# EAGLE design rev3 (EAGLE 7.2.0)
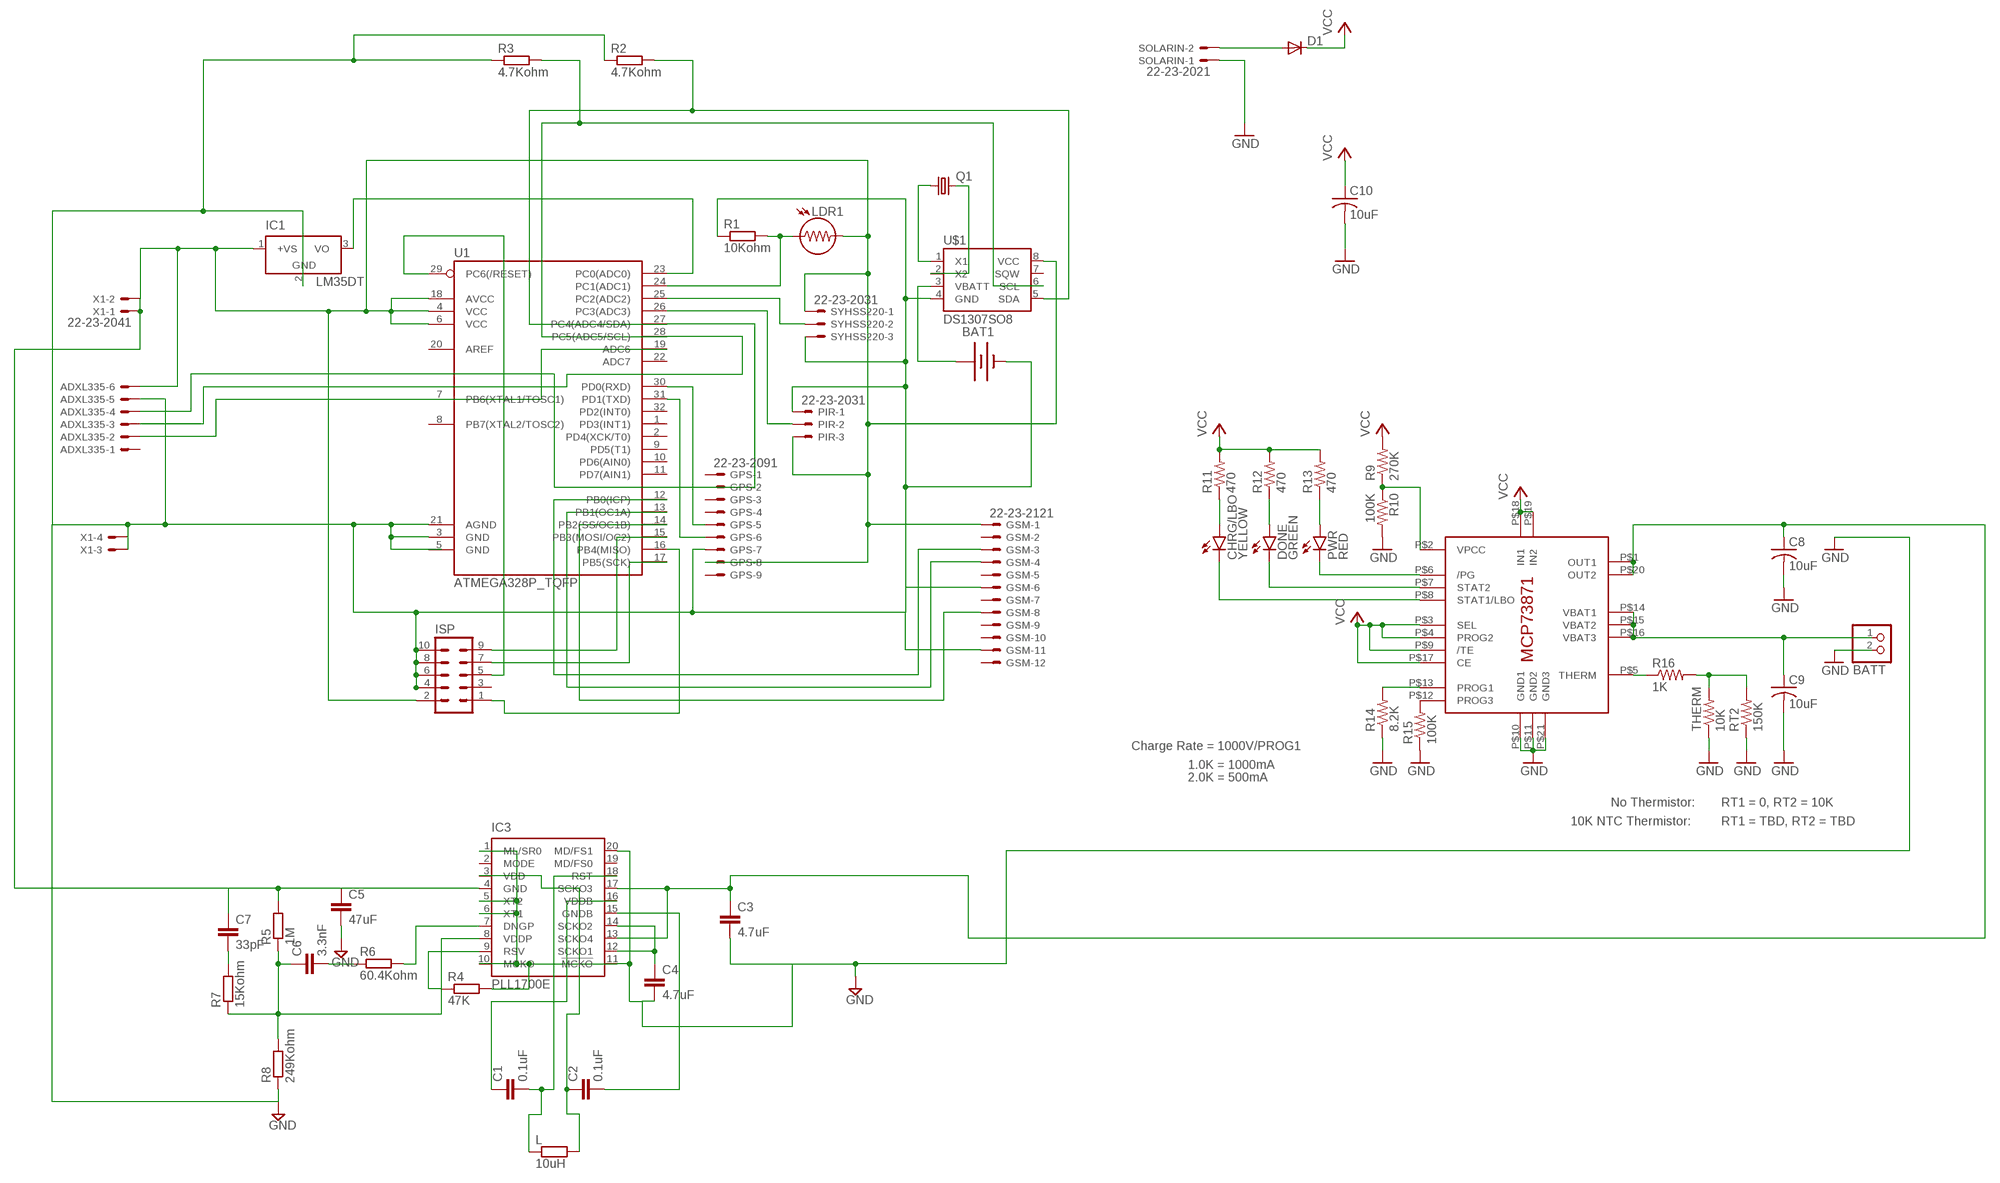
[diagram p0: schematic, sheet 1]

## Parts
ADXL335  22-23-2061  [22-23-2061]
BAT1  BATTERY20PTH  [BATTCOM_20MM_PTH]
BATT  JST_2PIN-SMT-RA  [JST-PH-2-SMT-RA]
C1  0.1uF  0.1UF-16V(+-10%)(0402)  [0402-CAP]
C2  0.1uF  0.1UF-16V(+-10%)(0402)  [0402-CAP]
C3  4.7uF  4.7UF-6.3V-10%(0603)0603  [0603-CAP]
C4  4.7uF  4.7UF-6.3V-10%(0603)0603  [0603-CAP]
C5  47uF  CAP0603-CAP  [0603-CAP]
C6  3.3nF  3.3NF-100V-10%(0603)  [0603-CAP]
C7  33pF  33PF-50V-5%-(0603)  [0603-CAP]
C8  10uF  C-USC0805K  [C0805K]
C9  10uF  C-USC0805K  [C0805K]
C10  10uF  C-USC0805K  [C0805K]
CHRG/LBO  YELLOW  LED-YELLOWLARGE  [LED-1206]
D1  DIODEPTH  [DIODE-1N4001]
DONE  GREEN  LED-GREENLARGE  [LED-1206]
GPS  22-23-2091  [22-23-2091]
GSM  22-23-2121  [22-23-2121]
IC1  LM35DT  [TO220V]
IC2  MCP73871  [QFN20_4MM]
IC3  PLL1700E  [SSOP20]
ISP  ML10  [ML10]
L  10uH  6MM-EU4  [R0207/4]
LDR1  LDR5MM  [LDR338-54C]
PIR  22-23-2031  [22-23-2031]
PWR  RED  LED-RED1206  [LED-1206]
Q1  CRYSTALTC26H  [TC26H]
R1  10Kohm  R-EU_M1206  [M1206]
R2  4.7Kohm  R-EU_M1206  [M1206]
R3  4.7Kohm  R-EU_M1206  [M1206]
R4  47K  R-EU_M3216  [M3216]
R5  1M  R-EU_M3216  [M3216]
R6  60.4Kohm  R-EU_M3216  [M3216]
R7  15Kohm  R-EU_M1206  [M1206]
R8  249Kohm  R-EU_M1206  [M1206]
R9  270K  R-US_R0805  [R0805]
R10  100K  R-US_R0805  [R0805]
R11  470  470OHM1/10W1%(0603)  [0603-RES]
R12  470  470OHM1/10W1%(0603)  [0603-RES]
R13  470  470OHM1/10W1%(0603)  [0603-RES]
R14  8.2K  8.2KOHM-1/10W-5%(0603)  [0603-RES]
R15  100K  R-US_R0805  [R0805]
R16  1K  R-US_M0805  [M0805]
RT2  150K  R-US_M0805  [M0805]
SOLARIN  22-23-2021  [22-23-2021]
SYHSS220  22-23-2031  [22-23-2031]
THERM  10K  R-US_FLIPFLOP  [0805-THM]
U1  ATMEGA328P_TQFP  [TQFP32-08]
U$1  DS1307SO8  [SO08]
X1  22-23-2041  [22-23-2041]

## Nets
BATT: BATT.1 C9.1 IC2.P$14(VBAT1) IC2.P$15(VBAT2) IC2.P$16(VBAT3)
GND: ADXL335.5 BAT1.2(-) BATT.2 C3.2 C4.2 C5.2 C8.2 C9.2 C10.2 GPS.7 GSM.6 GSM.11 IC1.2(GND) IC2.P$10(GND1) IC2.P$11(GND2) IC2.P$21(GND3) IC3.1(ML/SR0) IC3.5(XT2) IC3.6(XT1) IC3.10(MCKO) IC3.11(!MCKO) IC3.20(MD/FS1) ISP.4 ISP.6 ISP.8 ISP.10 PIR.1 R1.1 R2.1 R3.1 R4.2 R8.1 R10.2 R14.1 R15.1 RT2.1 SOLARIN.1 SYHSS220.3 THERM.1 U1.3(GND) U1.21(AGND) U$1.4(GND) X1.3 X1.4
N$3: GPS.5 U1.30(PD0(RXD))
N$4: IC1.3(VO) U1.23(PC0(ADC0))
N$5: LDR1.1 R1.2 U1.24(PC1(ADC1))
N$6: GPS.6 U1.31(PD1(TXD))
N$7: SYHSS220.2 U1.25(PC2(ADC2))
N$8: PIR.2 U1.26(PC3(ADC3))
N$9: ADXL335.2 U1.19(ADC6)
N$10: ADXL335.3 R3.2 U1.28(PC5(ADC5/SCL)) U$1.6(SCL)
N$11: GSM.3 U1.12(PB0(ICP))
N$12: Q1.1 U$1.1(X1)
N$13: Q1.2 U$1.2(X2)
N$14: GSM.4 U1.13(PB1(OC1A))
N$15: BAT1.1(+) U$1.3(VBATT)
N$16: GSM.8 U1.14(PB2(SS/OC1B))
N$17: IC2.P$2(VPCC) R9.1 R10.1
N$18: IC2.P$6(/PG) PWR.C
N$20: ISP.1 U1.16(PB4(MISO))
N$21: ISP.5 U1.29(PC6(/RESET))
N$22: ISP.7 U1.17(PB5(SCK))
N$23: ISP.9 U1.15(PB3(MOSI/OC2))
N$27: DONE.C IC2.P$7(STAT2)
N$28: CHRG/LBO.C IC2.P$8(STAT1/LBO)
N$29: C1.1 IC3.16(VDDB)
N$30: CHRG/LBO.A R11.1
N$31: DONE.A R12.1
N$32: C2.2 IC3.15(GNDB)
N$33: PWR.A R13.1
N$34: IC2.P$12(PROG3) R15.2
N$35: C1.2 IC3.18(RST) L.1
N$36: C2.1 IC3.3(VDD) L.2
N$37: ADXL335.6 C5.1 C7.1 GPS.8 GSM.1 IC1.1(+VS) IC3.4(GND) ISP.2 LDR1.2 PIR.3 R5.2 SYHSS220.1 U1.4(VCC) U1.6(VCC) U1.18(AVCC) U$1.8(VCC) X1.1 X1.2
N$38: C6.1 IC3.8(VDDP) R5.1 R7.1 R8.2
N$40: C6.2 R6.1
N$41: IC3.7(DNGP) R6.2
N$42: ADXL335.4 R2.2 U1.27(PC4(ADC4/SDA)) U$1.5(SDA)
N$43: C7.2 R7.2
N$44: C4.1 IC3.12(SCKO1) IC3.14(SCKO2)
N$45: IC3.9(RSV) R4.1
N$46: IC2.P$13(PROG1) R14.2
N$47: IC2.P$5(THERM) R16.1
N$48: R16.2 RT2.2 THERM.2
N$49: D1.A SOLARIN.2
OUT: C3.1 C8.1 IC2.P$1(OUT1) IC2.P$20(OUT2) IC3.13(SCKO4) IC3.17(SCKO3)
VCC: C10.1 D1.C IC2.P$3(SEL) IC2.P$4(PROG2) IC2.P$9(/TE) IC2.P$17(CE) IC2.P$18(IN1) IC2.P$19(IN2) R9.2 R11.2 R12.2 R13.2
Unconnected: ADXL335.1 GPS.1 GPS.2 GPS.3 GPS.4 GPS.9 GSM.2 GSM.5 GSM.7 GSM.9 GSM.10 GSM.12 IC3.2(MODE) IC3.19(MD/FS0) ISP.3 U1.1(PD3(INT1)) U1.2(PD4(XCK/T0)) U1.5(GND) U1.7(PB6(XTAL1/TOSC1)) U1.8(PB7(XTAL2/TOSC2)) U1.9(PD5(T1)) U1.10(PD6(AIN0)) U1.11(PD7(AIN1)) U1.20(AREF) U1.22(ADC7) U1.32(PD2(INT0)) U$1.7(SQW)

## Notes on the sheet
- Charge Rate = 1000V/PROG1
- 1.0K = 1000mA
- 2.0K = 500mA
- No Thermistor: | RT1 = 0, RT2 = 10K
- 10K NTC Thermistor: | RT1 = TBD, RT2 = TBD

## Library data of the parts
ADXL335 = con-molex:22-23-2061: .100" (2.54mm) Center Header - 6 Pin; MF: MOLEX; MPN: 22-23-2061; OC_FARNELL: 1462922; OC_NEWARK: 27C1933
BAT1 = SparkFun:BATTERY: Battery Holders Various common sizes : AA, AAA, 20mm coin cell and 12mm coin cell.
BATT = adafruit:JST_2PIN: JST 2-Pin Connectors of various flavors SMT-RA (S2B-PH-SM4) 4UConnector #17311 SMT (B2B-PH-SM4) THM-RA (S2B-PH) THM (B2B-PH)
C1 C2 = SparkFun-Capacitors:0.1UF-16V(+-10%)(0402); PROD_ID: CAP-12416
C3 C4 = SparkFun-Capacitors:4.7UF-6.3V-10%(0603): CAP-08280; PROD_ID: CAP-08280
C5 = SparkFun:CAP: Capacitor Standard 0603 ceramic capacitor, and 0.1" leaded capacitor.
C6 = SparkFun-Capacitors:3.3NF-100V-10%(0603): CAP-09633; PROD_ID: CAP-09633
C7 = SparkFun-Capacitors:33PF-50V-5%-(0603): CAP-10142; PROD_ID: CAP-10142
C8-C10 = adafruit:C-US: CAPACITOR, American symbol
CHRG/LBO = SparkFun-LED:LED-YELLOW: Yellow SMD LEDs LilyPad 1206- DIO-09909 0603- DIO-09003; PROD_ID: DIO-00820
D1 = SparkFun:DIODE: Diode These are standard reverse protection diodes and small signal diodes. SMA package can handle up to about 1A. SOD-323 can handle about 200mA. What the SOD-323 package when ordering, there are some mfgs out there that are 5-pin packages.
DONE = SparkFun-LED:LED-GREEN: Various green LEDs Green LEDs used in SFE Production 0603- DIO-00821 LARGE- DIO-00862 LILYPAD- DIO-09910; PROD_ID: DIO-00862
GPS = con-molex:22-23-2091: .100" (2.54mm) Center Header - 9 Pin; MF: MOLEX; MPN: 22-23-2091; OC_FARNELL: 1756827; OC_NEWARK: 56H0450
GSM = con-molex:22-23-2121: .100" (2.54mm) Center Header - 12 Pin; MF: MOLEX; MPN: 22-23-2121; OC_FARNELL: 1462935; OC_NEWARK: 56H0456
IC1 = lm35:LM35: Single-Supply Centigrade Temperature Sensor Vout = (10mV/°C x Temp °C) +5mmmV Source: http://www.national.com/ds/LM/LM35.pdf
IC2 = adafruit:MCP73871
IC3 = texas:PLL1700*: MULTI-CLOCK GENERATOR GENERATED AUDIO SYSTEM CLOCK Phase Lock Loop (PLL).; MF: TEXAS INSTRUMENT CONNECTORS; MPN: PLL1700E; OC_FARNELL: unknown; OC_NEWARK: 36K3452
ISP = con-harting-ml:ML10: HARTING; OC_FARNELL: unknown; OC_NEWARK: unknown
L = gm-resistors:6MM-EU: 6mm Resistors (European schematic symbol) Leads spaced 1-6 holes apart for 0.1" perfboard. Suitable for 1/4 watt resistors.
LDR1 = gm-resistors:LDR
PIR SYHSS220 = con-molex:22-23-2031: .100" (2.54mm) Center Header - 3 Pin; MF: MOLEX; MPN: 22-23-2031; OC_FARNELL: 1462950; OC_NEWARK: 30C0862
PWR = SparkFun-LED:LED-RED: Assorted Red LEDs LilyPad 1206- DIO-09912 1206- DIO-00809 0603- DIO-00819; PROD_ID: DIO-00809
Q1 = crystal:CRYSTAL: CRYSTAL; OC_FARNELL: unknown; OC_NEWARK: unknown
R1-R8 = resistor:R-EU_: RESISTOR, European symbol
R9 R10 R15 R16 RT2 THERM = adafruit:R-US_: RESISTOR, American symbol
R11-R13 = SparkFun-Resistors:470OHM1/10W1%(0603): RES-07869; PROD_ID: RES-07869
R14 = SparkFun-Resistors:8.2KOHM-1/10W-5%(0603): RES-10646; PROD_ID: RES-10646
SOLARIN = con-molex:22-23-2021: .100" (2.54mm) Center Header - 2 Pin; MF: MOLEX; MPN: 22-23-2021; OC_FARNELL: 1462926; OC_NEWARK: 25C3832
U1 = SparkFun-DigitalIC:ATMEGA328P_TQFP; PROD_ID: IC-09069
U$1 = SparkFun:DS1307
X1 = con-molex:22-23-2041: .100" (2.54mm) Center Header - 4 Pin; MF: MOLEX; MPN: 22-23-2041; OC_FARNELL: 1462920; OC_NEWARK: 38C0355

## Board
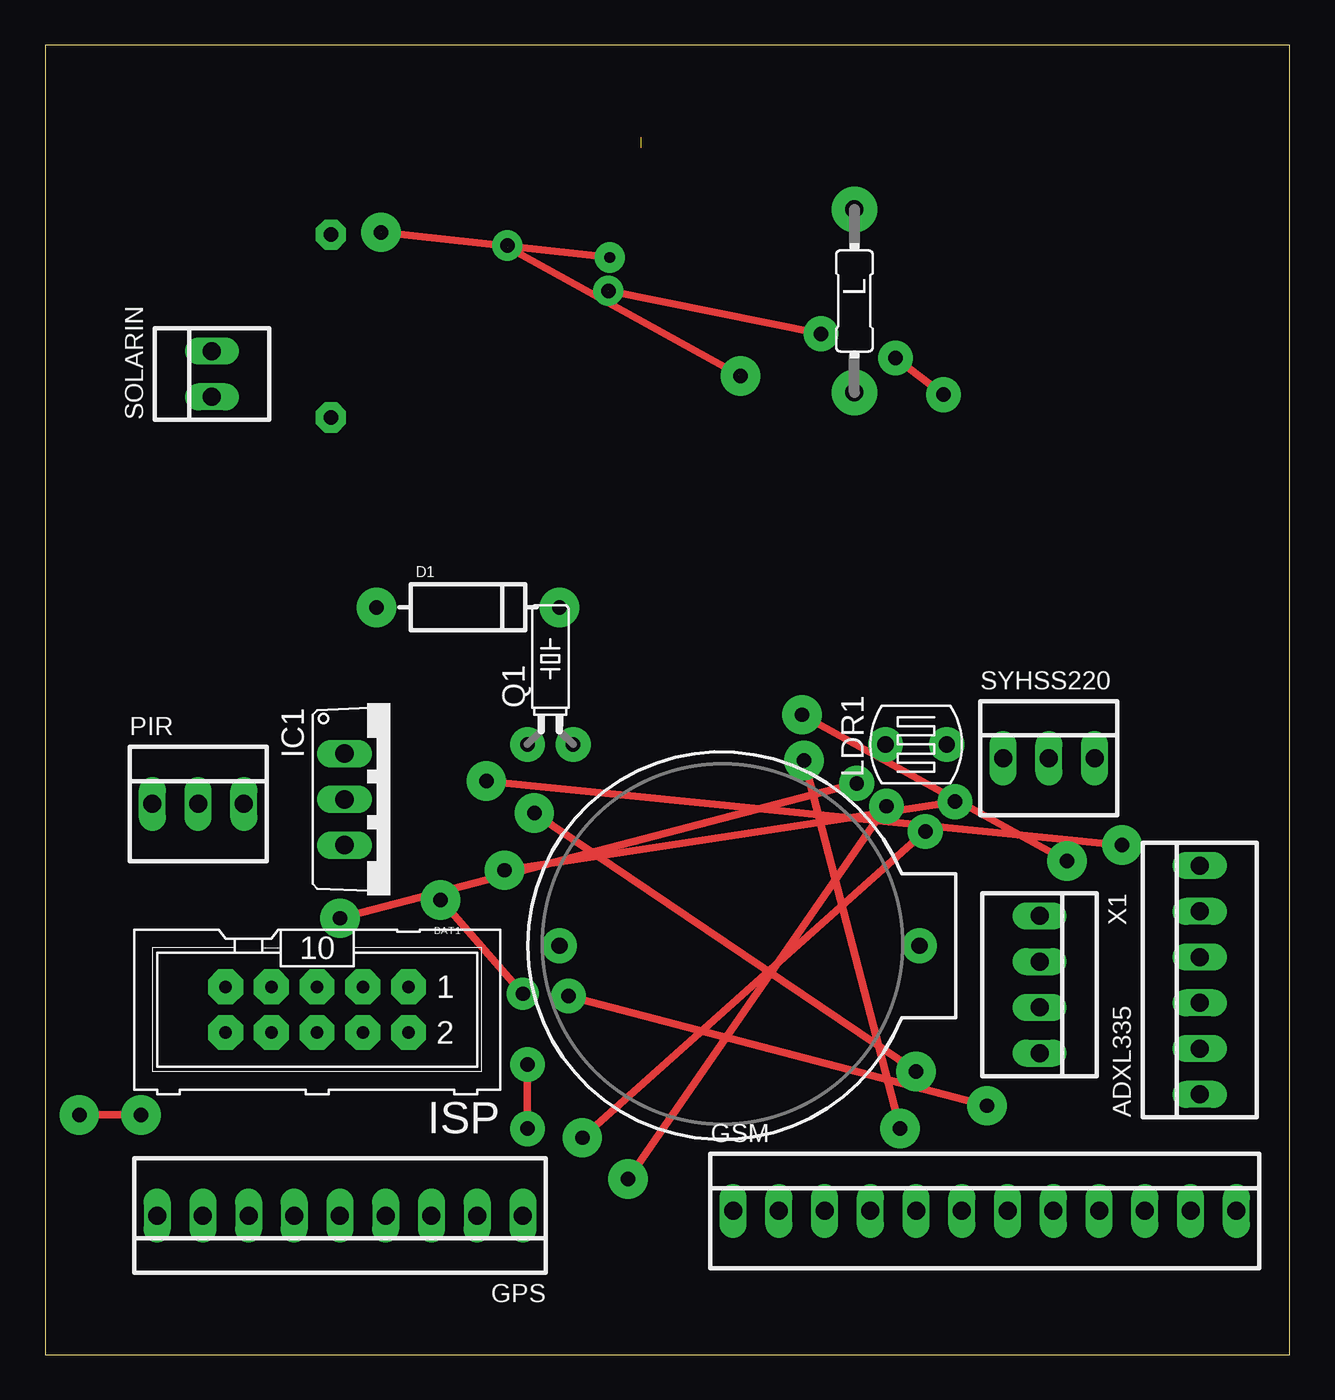
[diagram p1: board, top side]
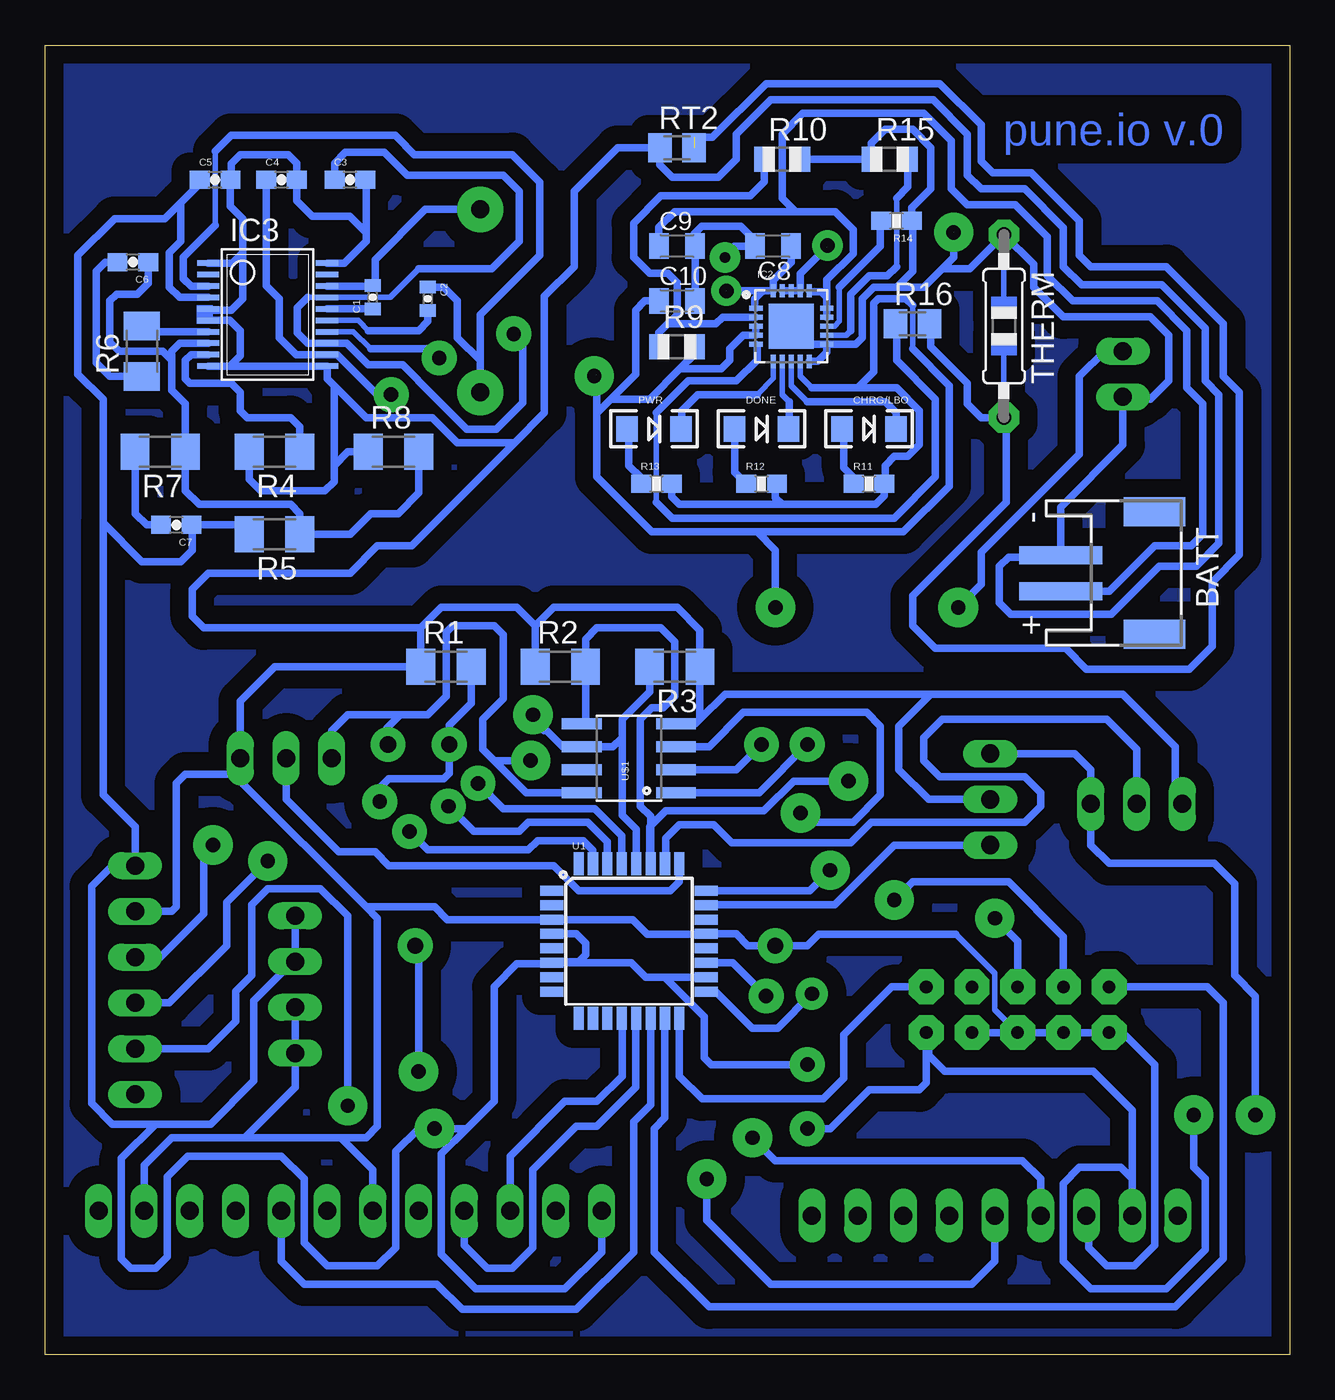
[diagram p2: board, bottom side, seen from below]

Size 69.14 x 72.76 mm. Coordinates in mm from the lower left corner, seen from the top.
Outline: 0,0 69.14,0 69.14,72.76 0,72.76 0,0
Copper layers (1*16): Top 0.035mm / dielectric 1.5mm / Bottom 0.035mm
Design rules "default": minimum track width 10mil, minimum drill 24mil, track to track 8mil, track to pad 8mil, pad to pad 8mil, via to via 8mil, smd to smd 8mil, copper to edge 40mil, drill to drill 8mil, minimum pad ring 10mil, minimum via ring 8mil, stop-mask expansion 4mil, vias tented up to drill 0mil, thermal gap 10mil

### Footprints (pad centres in the part's own frame; a part is rotated, then mirrored left to right if it is on the bottom)
22-23-2061 = drill 1 long: 1 -6.35,0; 2 -3.81,0; 3 -1.27,0; 4 1.27,0; 5 3.81,0; 6 6.35,0
BATTCOM_20MM_PTH = drill 0.9 pad 1.93: 1 20,0; 2 0,0
JST-PH-2-SMT-RA = smd 1 x 4.6: 1 1,-3.7; 2 -1,-3.7 | smd 1.6 x 3.4: NC1 -3.4,1.5; NC2 3.4,1.5
0402-CAP = smd 0.7 x 0.9: 1 -0.65,0; 2 0.65,0
0603-CAP = smd 1.1 x 1: 1 -0.85,0; 2 0.85,0
C0805K = smd 1.1 x 1.4: 1 -1,0; 2 1,0
LED-1206 = smd 1.2 x 1.4: A -1.5,0; C 1.5,0
DIODE-1N4001 = drill 0.8 pad 2.2: A -5.08,0; C 5.08,0
22-23-2091 = drill 1 long: 1 -10.16,0; 2 -7.62,0; 3 -5.08,0; 4 -2.54,0; 5 0,0; 6 2.54,0; 7 5.08,0; 8 7.62,0; 9 10.16,0
22-23-2121 = drill 1 long: 1 -13.97,0; 2 -11.43,0; 3 -8.89,0; 4 -6.35,0; 5 -3.81,0; 6 -1.27,0; 7 1.27,0; 8 3.81,0; 9 6.35,0; 10 8.89,0; 11 11.43,0; 12 13.97,0
TO220V = drill 1.016 long: 1 -2.54,-2.54; 2 0,-2.54; 3 2.54,-2.54
QFN20_4MM = smd 0.73 x 0.28: P$1 -1.965,1; P$2 -1.965,0.5; P$3 -1.965,0; P$4 -1.965,-0.5; P$5 -1.965,-1; P$11 1.965,-1; P$12 1.965,-0.5; P$13 1.965,0; P$14 1.965,0.5; P$15 1.965,1 | smd 0.28 x 0.73: P$6 -1,-1.965; P$7 -0.5,-1.965; P$8 0,-1.965; P$9 0.5,-1.965; P$10 1,-1.965; P$16 1,1.965; P$17 0.5,1.965; P$18 0,1.965; P$19 -0.5,1.965; P$20 -1,1.965 | smd 2.5 x 2.5: P$21 0,0
SSOP20 = smd 0.305 x 1.245: 1 -2.857,-3.302; 2 -2.222,-3.302; 3 -1.587,-3.302; 4 -0.952,-3.302; 5 -0.317,-3.302; 6 0.318,-3.302; 7 0.953,-3.302; 8 1.588,-3.302; 9 2.223,-3.302; 10 2.858,-3.302; 11 2.858,3.302; 12 2.223,3.302; 13 1.588,3.302; 14 0.953,3.302; 15 0.318,3.302; 16 -0.317,3.302; 17 -0.952,3.302; 18 -1.587,3.302; 19 -2.222,3.302; 20 -2.857,3.302
ML10 = drill 0.7 pad 1.93 octagon: 1 -5.08,-1.27; 2 -5.08,1.27; 3 -2.54,-1.27; 4 -2.54,1.27; 5 0,-1.27; 6 0,1.27; 7 2.54,-1.27; 8 2.54,1.27; 9 5.08,-1.27; 10 5.08,1.27
R0207/4 = drill 1 pad 2.54: 1 -5.08,0; 2 5.08,0
LDR338-54C = drill 0.9 pad 1.93: 1 0,1.702; 2 0,-1.702
22-23-2031 = drill 1 long: 1 -2.54,0; 2 0,0; 3 2.54,0
TC26H = drill 0.8 pad 1.93: 1 -1.27,0; 2 1.27,0
M1206 = smd 1.6 x 2: 1 -1.4,0; 2 1.4,0
M3216 = smd 1.6 x 2: 1 -1.4,0; 2 1.4,0
R0805 = smd 1.1 x 1.4: 1 -1,0; 2 1,0
0603-RES = smd 1.1 x 1: 1 -0.85,0; 2 0.85,0
M0805 = smd 1.3 x 1.6: 1 -0.95,0; 2 0.95,0
22-23-2021 = drill 1 long: 1 -1.27,0; 2 1.27,0
0805-THM = drill 0.813 pad 1.676 octagon: 1 -5.08,0; 2 5.08,0
TQFP32-08 = smd 1.27 x 0.559: 1 -4.293,2.8; 2 -4.293,2; 3 -4.293,1.2; 4 -4.293,0.4; 5 -4.293,-0.4; 6 -4.293,-1.2; 7 -4.293,-2; 8 -4.293,-2.8; 17 4.293,-2.8; 18 4.293,-2; 19 4.293,-1.2; 20 4.293,-0.4; 21 4.293,0.4; 22 4.293,1.2; 23 4.293,2; 24 4.293,2.8 | smd 0.559 x 1.27: 9 -2.8,-4.293; 10 -2,-4.293; 11 -1.2,-4.293; 12 -0.4,-4.293; 13 0.4,-4.293; 14 1.2,-4.293; 15 2,-4.293; 16 2.8,-4.293; 25 2.8,4.293; 26 2,4.293; 27 1.2,4.293; 28 0.4,4.293; 29 -0.4,4.293; 30 -1.2,4.293; 31 -2,4.293; 32 -2.8,4.293
SO08 = smd 0.61 x 2.21: 1 -1.905,-2.616; 2 -0.635,-2.616; 3 0.635,-2.616; 4 1.905,-2.616; 5 1.905,2.616; 6 0.635,2.616; 7 -0.635,2.616; 8 -1.905,2.616
22-23-2041 = drill 1 long: 1 -3.81,0; 2 -1.27,0; 3 1.27,0; 4 3.81,0

### Placement (x,y rotation side)
ADXL335  64.14,20.83 90 top
BAT1  28.57,22.73 0 top
BATT  9.02,43.43 270 bottom
C1  50.93,58.75 90 bottom
C2  47.88,58.67 270 bottom
C3  52.2,65.28 0 bottom
C4  56.01,65.28 0 bottom
C5  59.69,65.28 0 bottom
C6  64.26,60.71 180 bottom
C7  61.85,46.1 180 bottom
C8  28.7,61.59 180 bottom
C9  34.04,61.59 0 bottom
C10  34.04,58.55 0 bottom
CHRG/LBO  23.37,51.44 0 bottom
D1  23.49,41.53 0 top
DONE  29.34,51.44 0 bottom
GPS  16.38,7.75 180 top
GSM  52.2,8 0 top
IC1  19.18,30.86 270 top
IC2  27.69,57.15 0 bottom
IC3  56.77,57.78 270 bottom
ISP  15.11,19.18 180 top
L  44.96,58.55 270 top
LDR1  48.39,33.91 90 top
PIR  8.51,30.61 0 top
PWR  35.31,51.44 0 bottom
Q1  28.07,33.91 0 top
R1  46.86,38.23 0 bottom
R2  40.51,38.23 0 bottom
R3  34.16,38.23 180 bottom
R4  56.39,50.16 180 bottom
R5  56.39,45.59 180 bottom
R6  63.75,55.75 90 bottom
R7  62.74,50.16 180 bottom
R8  49.78,50.16 0 bottom
R9  34.04,56.01 0 bottom
R10  28.19,66.42 0 bottom
R11  23.37,48.39 0 bottom
R12  29.34,48.39 0 bottom
R13  35.18,48.39 0 bottom
R14  21.84,62.99 180 bottom
R15  22.22,66.42 0 bottom
R16  20.95,57.28 0 bottom
RT2  34.04,67.06 0 bottom
SOLARIN  9.27,54.48 90 top
SYHSS220  55.75,33.15 0 top
THERM  15.88,57.15 270 bottom
U1  36.7,22.99 0 bottom
U$1  36.7,33.15 90 bottom
X1  55.24,20.57 270 top

### Tracks (layer width: path | path; a pad name or v marks a point on that pad's centre or on a via)
BATT
  Bottom 0.406: 25.72,58.74 IC2.P$15 IC2.P$14 | IC2.P$16 26.63,59.05 26.04,59.05 25.72,58.74 | C9.1 35.04,62.63 34.16,63.5 27.43,63.5 | BATT.1 10.02,42.43 7.49,44.96 5.46,44.96 4.83,45.59 4.83,52.83 5.71,53.72 5.71,56.9 7.37,58.55 12.06,58.55 13.46,59.94 13.46,62.1 15.24,63.88 17.91,63.88 18.8,64.77 18.8,67.44 20.32,68.96 27.05,68.96 28.19,67.82 28.19,64.26 27.43,63.5 | 27.43,63.5 25.25,63.5 24.26,62.51 24.26,61.16 25.7,59.72 25.7,58.73 25.72,58.74
GND  (via drill 0.6 pad 1.68)  (1 unrouted)
  Top 0.406: v31.37,60.96 18.67,62.36
  Bottom 0.305: 18.54,23.37 16.38,21.21 16.38,19.18 ISP.6
  Bottom 0.406: ISP.4 ISP.6 ISP.8 ISP.10 9.27,17.91 7.49,16.13 7.49,6.1 8.64,4.95 10.16,4.95 11.18,5.97 11.18,7.62 GPS.7 | 48.26,40.39 48.26,40.38 R1.1 56.39,38.23 58.29,36.32 SYHSS220.3 58.29,31.88 | R3.1 32.77,40.26 34.04,41.53 40.89,41.53 41.91,40.51 R2.1 41.91,40.51 42.93,41.53 47.12,41.53 48.26,40.39 | R3.1 | R3.1 32.77,35.31 | 32.77,35.31 33.02,35.05 U$1.4 | IC1.2 20.07,30.86 21.72,32.51 21.72,34.92 19.94,36.7 | 19.94,36.7 9.27,36.7 6.35,33.78 6.35,30.99 PIR.1 | 60.07,57.53 IC3.6 60.01,57.47 | 58.17,61.21 58.17,63.12 58.84,63.79 C5.2 58.8,65.32 58.8,66.17 58.29,66.67 55.63,66.67 55.16,66.21 C4.2 55.16,64.1 54.3,63.25 52.22,63.25 51.31,62.33 | IC3.10 58.87,54.93 | 58.87,54.93 58.29,55.5 58.29,56.9 58.86,57.47 60.01,57.47 | R8.1 52.32,50.16 53.09,49.4 | 58.87,54.93 IC3.11 53.47,54.23 53.09,53.85 | R4.2 57.79,48.64 57.15,48.01 53.59,48.01 53.09,48.51 53.09,49.4 | IC3.1 58.74,60.64 58.17,61.21 | 58.17,61.21 58.17,58.67 58.8,58.04 60.01,58.04 IC3.5 60.07,57.53 | 60.01,57.47 60.07,57.53 | IC3.20 52.52,60.64 51.31,61.85 51.31,62.33 | 51.31,62.33 51.31,65.24 C3.2 | BAT1.2 28.45,22.73 | 51.31,24.89 47.5,24.89 46.79,24.19 U1.3 36.51,24.19 35.69,23.37 32.43,23.37 U1.21 30.75,23.39 30.1,22.73 BAT1.2 | 43.05,50.67 46.23,50.67 47.62,52.07 51.31,52.07 53.09,53.85 | 43.05,50.67 41.4,52.32 41.4,58.8 39.75,60.45 39.75,64.64 37.34,67.06 RT2.1 34.99,66.1 34.29,65.41 31.75,65.41 30.73,66.42 30.73,67.82 28.83,69.72 19.81,69.72 17.91,67.82 17.91,65.53 17.14,64.77 14.73,64.77 12.57,62.61 12.57,60.45 11.56,59.44 7.11,59.44 4.7,57.02 4.7,54.1 3.94,53.34 3.94,45.09 5.21,43.81 7.24,43.81 9.91,41.15 15.49,41.15 16.13,41.78 16.13,43.81 15.62,44.32 12.83,44.32 BATT.2 12.72,47.1 9.27,50.55 9.27,53.09
  Bottom 0.406: 43.05,50.67 48.77,44.96 50.67,44.96 52.2,43.43 60.07,43.43 60.96,42.55 60.96,41.02 60.32,40.39 48.26,40.39 | 19.94,36.7 31.37,36.7 32.77,35.31 | 18.54,23.37 26.16,23.37 26.8,22.73 BAT1.2 | 53.09,49.4 53.09,53.85 | GSM.11 63.63,10.54 62.1,12.06 58.04,12.06 | 58.04,12.06 55.24,14.86 X1.4 X1.3 | GSM.6 50.93,10.29 52.7,12.06 | 52.7,12.06 58.04,12.06 | ADXL335.5 62.1,24.64 61.85,24.89 61.85,31.75 61.34,32.26 58.67,32.26 58.29,31.88 | 58.29,31.88 51.31,24.89 | 51.31,24.89 50.67,24.26 50.67,12.7 51.31,12.06 52.7,12.06 | C10.2 C9.2 33.07,61.63 33.07,62.28 32.66,62.69 30.5,62.69 29.7,61.88 C8.2 30.86,61.59 v31.37,60.96 | IC2.P$11 25.72,55.69 26.22,55.19 IC2.P$10 | IC2.P$11 26.69,56.15 IC2.P$21 26.67,56.13 24.13,56.13 24.11,56.15 | IC2.P$11 24.11,56.15 | 24.11,56.15 23.75,56.52 23.75,58.67 23.11,59.31 21.84,59.31 | R10.2 R15.1 23.24,66.44 23.24,67.31 22.48,68.07 20.95,68.07 19.94,67.06 19.94,64.77 20.99,63.72 R14.1 20.95,62.95 20.95,60.2 21.84,59.31 | 21.84,59.31 20.32,59.31 19.3,60.33 | 19.3,60.33 17.78,60.33 THERM.1 14.22,60.58 14.22,59.31 12.57,57.66 7.75,57.66 6.73,56.64 6.73,54.1 7.75,53.09 9.27,53.09 | 9.27,53.09 SOLARIN.1 | 19.3,60.33 18.67,60.96 18.67,62.36
N$2
  pour Bottom (isolate 1.016): 0.64,72.26 68.58,72.26 68.58,0.89 0.64,0.89
N$3  (via drill 0.8 pad 1.93, 0.8 pad 2.18)
  Top 0.406: v32.38,9.78 v46.74,30.48
  Bottom 0.406: GPS.5 16.38,5.21 17.65,3.94 28.83,3.94 32.38,7.49 v32.38,9.78 | U1.30 37.9,28.5 38.99,29.59 42.29,29.59 42.8,29.08 45.34,29.08 v46.74,30.48
N$4
  Bottom 0.406: IC1.3 21.97,28.32 25.27,25.02 32.38,25.02 U1.23
N$5  (via drill 0.8 pad 1.93, 0.8 pad 2.18)
  Top 0.406: v25.53,26.92 v50.55,30.73
  Bottom 0.406: 45.08,37.85 R1.2 | 45.59,38.1 R1.2 | R1.2 45.47,36.2 46.68,34.98 LDR1.1 46.68,32.31 46.99,32 50.04,32 50.55,31.5 v50.55,30.73 | U1.24 26.66,25.79 v25.53,26.92
N$6  (via drill 0.8 pad 1.93, 0.8 pad 2.18)
  Top 0.406: v29.84,12.06 v48.89,29.08
  Bottom 0.406: GPS.6 13.84,9.78 14.86,10.79 28.57,10.79 v29.84,12.06 | U1.31 38.7,28.04 39.24,28.57 41.78,28.57 42.29,28.07 47.88,28.07 v48.89,29.08
N$7
  Bottom 0.406: SYHSS220.2 55.75,30.86 52.83,27.94 50.8,27.94 50.04,27.18 40.89,27.18 39.5,25.78 34.42,25.78 33.91,26.29 U1.25
N$8
  Bottom 0.406: PIR.2 8.51,33.66 10.16,35.31 19.3,35.31 20.32,34.29 20.32,33.02 19.43,32.13 14.73,32.13 13.84,31.24 13.84,30.48 14.73,29.59 23.24,29.59 24.38,28.45 30.99,28.45 32,29.46 33.91,29.46 34.67,28.7 34.67,27.31 U1.26
N$9  (via drill 0.8 pad 1.93, 0.8 pad 2.18)
  Top 0.406: v52.32,13.84 v29.08,19.94
  Bottom 0.406: U1.19 30.93,21.79 v29.08,19.94 | ADXL335.2 60.07,17.02 58.55,18.54 58.55,20.19 57.66,21.08 57.66,25.02 56.77,25.91 53.85,25.91 52.32,24.38 v52.32,13.84
N$10  (via drill 0.8 pad 2.18)
  Top 0.406: v56.77,27.43 v42.04,35.56
  Bottom 0.406: R3.2 35.56,36.83 37.08,35.31 37.08,34.29 | 36.32,27.3 U1.28 36.3,29.19 37.08,29.97 37.08,34.29 | 37.08,34.29 37.59,33.78 U$1.6 40.39,33.78 41.27,34.67 41.4,34.67 v42.04,35.56 | ADXL335.3 62.23,19.56 59.05,22.73 59.05,25.15 v56.77,27.43
N$11
  Bottom 0.406: GSM.3 43.31,11.05 40.26,14.1 38.48,14.1 37.08,15.49 37.08,18.68 U1.12
N$12
  Bottom 0.406: U$1.1 29.46,31.24 Q1.1
N$13
  Bottom 0.406: U$1.2 30.73,32.51 Q1.2
N$14
  Bottom 0.406: GSM.4 45.85,6.1 44.58,4.83 43.18,4.83 42.04,5.97 42.04,10.29 39.62,12.7 38.48,12.7 36.32,14.86 36.32,18.68 U1.13
N$15  (via drill 0.8 pad 2.18)
  Top 0.406: v48.39,15.75 v27.18,30.1
  Bottom 0.406: U$1.3 32.26,33.78 30.35,35.69 23.49,35.69 22.73,34.92 22.73,31.11 24.26,29.59 26.67,29.59 v27.18,30.1 | BAT1.1 48.39,22.55 v48.39,15.75
N$16
  Bottom 0.406: U1.14 35.5,13.9 36.45,12.95 36.45,5.71 39.62,2.54 45.97,2.54 47.37,3.94 54.74,3.94 56.01,5.21 GSM.8 56.01,6.48
N$17
  Bottom 0.406: IC2.P$2 31.5,57.65 31.88,57.28 34.54,57.28 | R9.1 35.05,56.02 35.05,56.77 34.54,57.28 | 29.21,66.42 R10.1 29.19,65.17 29.97,64.39 34.92,64.39 36.45,62.87 36.45,60.96 35.56,60.07 34.54,60.07 34.04,59.56 34.04,57.78 34.54,57.28
N$18
  Bottom 0.305: IC2.P$6 28.69,54.24 29.59,53.34
  Bottom 0.406: 29.59,53.34 32.89,53.34 33.78,52.45 33.78,51.46 PWR.C
N$20
  Bottom 0.406: U1.16 33.9,15.49 32.64,14.22 25.91,14.22 24.76,15.37 24.76,17.78 22.1,20.45 ISP.1
N$21  (via drill 0.8 pad 1.93, 0.8 pad 2.18)
  Top 0.406: v16.38,24.26 v45.09,31.75
  Bottom 0.406: 37.08,27.26 U1.29 37.1,28.85 38.61,30.35 43.69,30.35 v45.09,31.75 | ISP.5 15.11,22.99 v16.38,24.26
N$22  (via drill 0.8 pad 1.78, 0.8 pad 2.18)
  Top 0.406: v26.54,20.07 v21.97,25.27
  Bottom 0.406: ISP.7 12.57,23.24 15.62,26.29 20.95,26.29 v21.97,25.27 | U1.17 31.87,20.19 29.84,18.16 28.45,18.16 v26.54,20.07
N$23
  Bottom 0.406: U1.15 34.7,13.18 35.31,12.57 35.31,5.71 32.26,2.67 6.35,2.67 3.68,5.33 3.68,19.56 4.57,20.45 ISP.9
N$27
  Bottom 0.305: IC2.P$7 28.19,53.33 27.81,52.96
  Bottom 0.406: 27.81,52.96 27.81,51.46 DONE.C
N$28
  Bottom 0.305: IC2.P$8 27.69,53.85 26.8,52.96
  Bottom 0.406: CHRG/LBO.C 21.87,52.35 22.48,52.96 26.8,52.96
N$29
  Bottom 0.406: 50.88,58.1 C1.1 IC3.16
N$30
  Bottom 0.406: R11.1 24.22,48.73 24.76,49.28 24.76,51.33 CHRG/LBO.A
N$31
  Bottom 0.406: DONE.A 30.84,49.04 R12.1
N$32
  Bottom 0.305: IC3.15 51.75,57.47 51.18,56.9
  Bottom 0.406: C2.2 47.88,57.4 48.39,56.9 51.18,56.9
N$33
  Bottom 0.406: R13.1 36.03,48.73 36.7,49.4 36.7,51.33 PWR.A
N$34
  Bottom 0.305: IC2.P$12 24.63,56.65 24.38,56.9 | 21.84,60.45 21.84,64.26
  Bottom 0.406: 24.38,56.9 24.38,58.93 23.37,59.94 22.35,59.94 21.84,60.45 | 21.84,64.26 21.21,64.9 21.21,66.41 R15.2
N$35
  Bottom 0.406: 50.85,59.37 C1.2 | L.1 48.01,63.63 50.8,60.83 50.8,59.53 C1.2 | IC3.18 50.95,59.37 C1.2
N$36
  Bottom 0.305: 59.69,62.74 59.69,66.85
  Bottom 0.406: 61.27,59.61 61.47,59.82 | 61.47,59.82 61.47,60.96 59.69,62.74 | L.2 44.96,55.24 | 44.96,55.24 46.23,56.52 46.23,58.55 46.99,59.31 47.86,59.31 C2.1 | IC3.3 61.02,59.37 61.27,59.61 | 61.27,59.61 61.29,59.61 61.47,59.79 61.47,59.82 | 59.69,66.85 58.8,67.74 49.68,67.74 49.1,67.16 49.1,67.13 48.64,66.67 43.18,66.67 41.66,65.15 41.66,61.09 44.96,57.78 44.96,55.24
N$37  (via drill 0.8 pad 1.93, 0.8 pad 2.18)
  Top 0.406: v47.5,12.57 v42.16,33.02 | v1.91,13.34 v5.33,13.34 | v26.8,12.57 v26.8,16.13
  Bottom 0.406: GSM.1 38.23,5.71 40.26,3.68 45.21,3.68 47.12,5.59 47.12,11.18 45.72,12.57 | 41.07,21.72 42.93,21.72 44.2,20.45 44.2,14.1 45.72,12.57 | 41.07,21.72 U1.6 | GPS.8 8.76,9.78 | 8.76,9.78 8.76,13.59 10.92,15.75 19.18,15.75 20.07,16.64 20.07,17.78 ISP.2 | IC1.1 11.94,33.4 11.05,32.51 PIR.3 11.05,28.32 10.03,27.3 4.19,27.3 3.05,26.16 3.05,21.08 1.91,19.94 v1.91,13.34 | 8.76,9.78 9.4,10.41 11.68,10.41 12.57,9.53 12.57,5.21 11.05,3.68 6.86,3.68 4.7,5.84 4.7,9.78 5.33,10.41 v5.33,13.34 | C5.1 60.54,65.06 61.59,64.01 | IC3.4 61.66,58.74 62.23,59.31 62.23,61.21 61.59,61.85 61.59,64.01 | R5.2 58.3,46.1 C7.1 60.96,46.06 60.96,44.7 61.59,44.07 63.75,44.07 65.91,46.23 | 61.59,64.01 62.48,63.12 65.28,63.12 67.31,61.09 67.31,54.48 65.91,53.09 65.91,46.23 | ISP.2 20.19,18.03 | 34.7,20.99 32.51,18.8 32.51,16.51 32.13,16.13 v26.8,16.13 | U1.6 39.55,21.79 39.5,21.84 | U1.6 36.58,21.79 35.78,20.99 34.7,20.99 | U1.18 34.7,20.99 | 49.4,35.56 47.88,35.56 46.86,36.58 46.86,40.13 46.48,40.51 44.2,40.51 43.69,40.01 43.69,36.45 44.83,35.31 44.83,33.66 44.2,33.02 | LDR1.2 50.16,33.98 50.16,34.8 49.4,35.56 | 49.4,35.56 52.32,35.56 53.21,34.67 SYHSS220.1 | U$1.8 42.42,31.24 44.2,33.02 | 44.2,33.02 v42.16,33.02 | U1.4 39.64,23.39 39.12,22.86 39.12,22.23 39.5,21.84 | 39.5,21.84 40.77,21.84 40.89,21.72 41.07,21.72 | 45.72,12.57 v47.5,12.57 48.39,12.57 49.66,11.3 49.66,5.97 50.67,4.95 53.47,4.95 54.74,6.22 54.74,9.78 56.01,11.05 61.21,11.05 62.36,9.91 62.36,5.46 62.99,4.83 64.39,4.83 64.9,5.33 64.9,10.92 62.99,12.83 | 62.99,12.83 59.94,12.83 57.53,15.24 57.53,19.68 55.37,21.84 X1.2 X1.1
  Bottom 0.406: 62.99,12.83 65.41,12.83 66.55,13.97 66.55,26.04 65.41,27.18 ADXL335.6 64.14,29.34 65.91,31.11 65.91,46.23 | ISP.2 20.19,15.11 20.57,14.73 23.37,14.73 25.53,12.57 v26.8,12.57
N$38
  Bottom 0.406: R8.2 48.39,47.88 49.53,46.74 51.05,46.74 52.2,45.59 R5.1 54.99,46.74 55.5,47.24 60.58,47.24 61.34,48 R7.1 61.34,52.83 62.1,53.59 62.1,55.24 | 62.1,55.24 62.61,55.75 65.02,55.75 65.53,56.26 65.53,58.55 65.15,58.93 64.01,58.93 63.41,59.52 C6.1 | 62.1,55.24 62.1,55.75 61.66,56.2 IC3.8
N$39  (via drill 0.8 pad 2.18)
  other vias: 38.63,54.38
N$40
  Bottom 0.406: R6.1 65.53,54.36 66.29,55.12 66.29,60.2 65.79,60.71 C6.2
N$41
  Bottom 0.406: IC3.7 63.43,56.83 R6.2
N$42  (via drill 0.8 pad 2.18)
  Top 0.406: v59.82,28.32 v24.51,31.88
  Bottom 0.406: U$1.5 39.11,35.26 R2.2 39.12,39.75 38.48,40.39 34.92,40.39 34.16,39.62 34.16,36.58 34.8,35.94 35.43,35.94 36.07,35.31 36.07,30.48 35.5,29.91 U1.27 35.56,27.34 35.56,29.34 34.67,30.23 29.21,30.23 27.56,31.88 v24.51,31.88 | ADXL335.4 62.74,22.1 60.32,24.51 60.32,27.94 59.94,28.32 v59.82,28.32
N$43
  Bottom 0.406: R7.2 64.14,46.74 63.5,46.1 C7.2
N$44  (via drill 0.8 pad 1.93)
  Top 0.406: v49.91,53.34 v47.24,55.37
  Bottom 0.305: IC3.14 52.01,56.83 51.05,55.88
  Bottom 0.406: C4.1 56.86,59.4 56.13,58.67 56.13,56.52 55.18,55.56 IC3.12 52.89,55.56 50.67,53.34 v49.91,53.34 | 51.05,55.88 47.75,55.88 v47.24,55.37
N$45
  Bottom 0.406: IC3.9 61.02,55.56 61.34,55.24 61.34,54.23 61.09,53.98 58.8,53.98 58.29,53.47 58.29,52.45 57.91,52.07 55.5,52.07 54.99,51.56 R4.1
N$46
  Bottom 0.305: IC2.P$13 25.27,57.15 25.02,57.4 25.02,59.31
  Bottom 0.406: 22.69,62.65 R14.2 22.73,62.95 22.73,61.59 25.02,59.31
N$47
  Bottom 0.305: 35.18,47.37 35.18,52.32
  Bottom 0.406: 35.18,47.37 34.29,46.48 21.97,46.48 19.68,48.77 19.68,53.09 21.84,55.24 21.84,57.22 R16.1 | 35.18,52.32 33.4,54.1 30.73,54.1 29.59,55.24 29.59,56.09 IC2.P$5
N$48  (1 unrouted)
  Bottom 0.406: R16.2 19.94,57.21 19.94,56.01 17.91,53.98 17.91,52.83 17.14,52.07 THERM.2 15.75,51.94 15.75,47.37 20.95,42.16 20.95,40.51 19.68,39.24 12.45,39.24 11.3,38.1 5.59,38.1 4.32,39.37 4.32,42.93 2.79,44.45 2.79,53.47 3.68,54.36 3.68,57.28 6.86,60.45 11.05,60.45 11.68,61.09 11.68,62.99 14.35,65.66 16.51,65.66 17.14,66.29 17.14,68.33 19.43,70.61 29.08,70.61 32.07,67.62 33.09,67.62
N$49
  Bottom 0.406: SOLARIN.2 10.29,55.75 11.68,54.36 11.68,50.04 17.14,44.58 17.14,42.8 D1.A
N$50  (via drill 0.8 pad 1.68)
  other vias: 25.68,61.62
N$52  (via drill 0.8 pad 1.68)
  other vias: 31.29,59.11
N$53  (via drill 0.8 pad 2.18)
  other vias: 18.67,62.36
OUT  (via drill 0.8 pad 1.93)  (1 unrouted)
  Top 0.406: 31.29,59.11 v43.1,56.72
  Bottom 0.305: 54.55,58.74 IC3.17 49.98,58.74 48.39,60.33
  Bottom 0.406: C8.1 27.69,60.71 28.69,59.71 IC2.P$20 29.28,59.12 29.34,59.05 | IC2.P$1 29.72,58.22 29.72,58.67 29.34,59.05 | C3.1 53.05,66.21 52.45,66.8 50.29,66.8 49.02,65.53 43.69,65.53 42.8,64.64 42.8,61.85 44.32,60.33 48.39,60.33 | 54.55,58.74 55.12,58.17 55.12,56.77 54.55,56.2 IC3.13 52.39,56.2 51.18,54.99 49.28,54.99 47.55,53.26 47.55,53.24 45.72,51.41 44.07,51.41 42.6,52.88 42.6,56.21 v43.1,56.72 | 29.34,59.05 29.31,59.05 29.26,59.11 31.29,59.11
VCC  (2 unrouted)
  Top 0.406: 25.7,61.52 38.53,54.46
  Bottom 0.305: IC2.P$9 27.19,54.36 26.54,53.72 | 20.95,55.88 20.95,58.29
  Bottom 0.406: IC2.P$17 IC2.P$18 IC2.P$19 IC2.P$17 27.18,59.11 27.18,60.05 25.7,61.52 | IC2.P$3 IC2.P$4 30.34,56.65 31.11,55.88 31.11,55.24 31.57,54.79 33.83,54.79 33.85,54.8 | 28.19,47.24 22.99,47.24 22.52,47.71 R11.2 22.48,48.43 22.48,49.4 21.97,49.91 21.21,49.91 20.57,50.55 20.57,52.45 21.84,53.72 24,53.72 | 28.19,47.24 28.57,47.62 28.57,48.3 R12.2 | 28.19,47.24 33.91,47.24 34.33,47.66 R13.2 34.42,48.48 | 26.54,53.72 24,53.72 | R9.2 33.04,55.61 33.85,54.8 | 33.85,54.8 35.56,53.09 37.72,53.09 | 37.72,53.09 38.43,52.38 | 38.43,52.38 38.48,52.32 38.48,48.77 35.43,45.72 29.59,45.72 | 29.59,45.72 21.46,45.72 18.92,48.26 18.92,53.85 20.95,55.88 | 20.95,58.29 21.34,58.67 22.86,58.67 23.11,58.42 23.11,54.61 24,53.72 | D1.C 28.57,44.7 29.59,45.72 | C10.1 35.81,58.55 36.32,58.04 36.32,54.48 37.44,53.37 | 37.44,53.37 37.64,53.16 | 37.44,53.37 37.44,53.29 37.57,53.16 37.64,53.16 | 37.64,53.16 37.72,53.09 | 38.43,52.38 38.46,52.38 38.48,52.35 38.48,54.41 38.53,54.46
(copper drawn outside any net)
  shapes: Bottom area x1

### Text on the board
Bottom: pune.io v.0